# EAGLE design Front Node_MiniLock_SMD Rs (EAGLE 8.0.2)
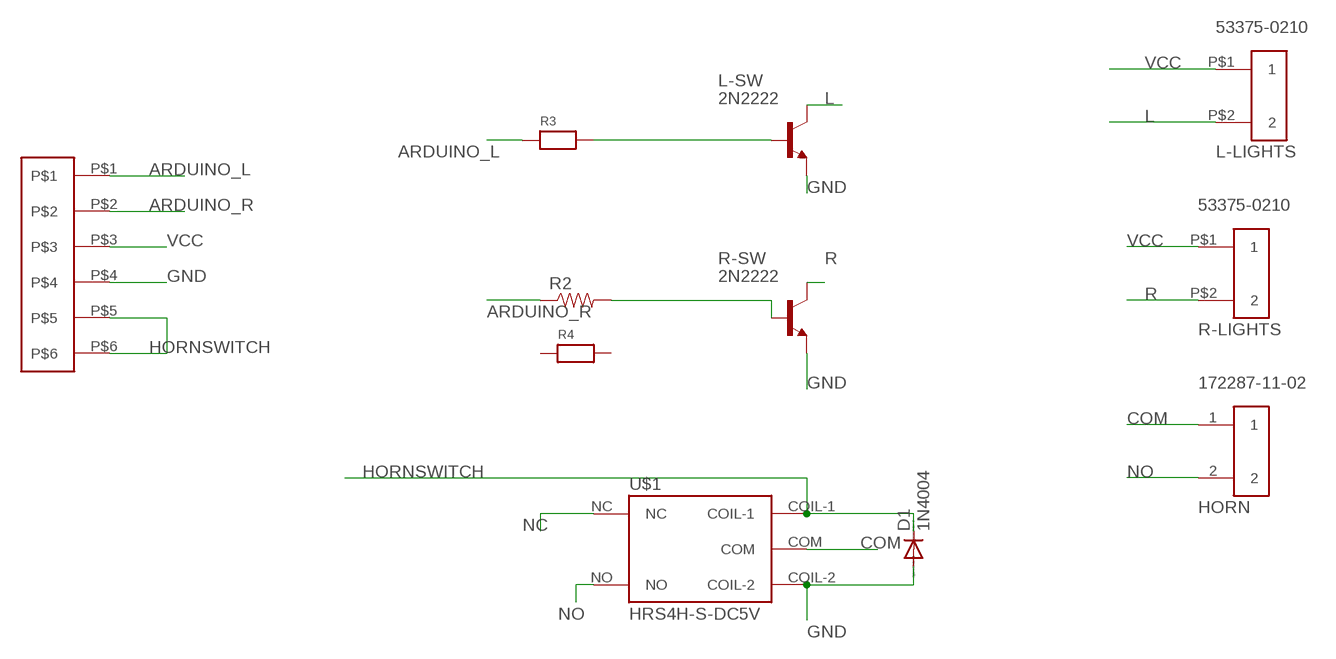
[diagram p0: schematic, sheet 1]

## Parts
ARDUINO  53375-0610  [53375-0610-MINI-LOCK]
D1  1N4004  [DO41-10]
HORN  172287-11-02  [172287-ULTRA-FIT]
L-LIGHTS  53375-0210  [53375-0210-MINI-LOCK]
L-SW  2N2222  [TO18]
R2  RESISTORPTH-1/4W  [AXIAL-0.4]
R3  RESISTOR1206  [1206]
R4  RESISTOR1206  [1206]
R-LIGHTS  53375-0210  [53375-0210-MINI-LOCK]
R-SW  2N2222  [TO18]
U$1  HRS4H-S-DC5V  [RELAY]

## Nets
ARDUINO_L: ARDUINO.P$1 R3.1
ARDUINO_R: ARDUINO.P$2 R2.P$1
COM: HORN.1 U$1.COM
GND: ARDUINO.P$4 D1.A L-SW.1(E) R-SW.1(E) U$1.COIL-2
HORNSWITCH: ARDUINO.P$5 ARDUINO.P$6 D1.C U$1.COIL-1
L: L-LIGHTS.P$2 L-SW.3(C)
N$5: R2.P$2 R-SW.2(B)
N$8: L-SW.2(B) R3.2
NC: U$1.NC
NO: HORN.2 U$1.NO
R: R-LIGHTS.P$2 R-SW.3(C)
VCC: ARDUINO.P$3 L-LIGHTS.P$1 R-LIGHTS.P$1
Unconnected: R4.1 R4.2

## Library data of the parts
ARDUINO = Hooman:53375-0610: Mini-Lock Header 6 pin 53375 series
D1 = diode:1N4004: DIODE general purpose rectifier, 1 A
HORN = Hooman:172287-11-02: Ultra-Fit™ 172287 Header Molex 3.5 mm pitch 2 pin connector header
L-LIGHTS R-LIGHTS = Hooman:53375-0210: Mini-Lock Header 2 pin 53375 series
L-SW R-SW = transistor-npn:2N2222*: NPN Transistor
R2 = SparkFun-Passives:RESISTOR: Resistor Basic schematic elements and footprints for 0603, 1206, and PTH resistors.
R3 R4 = microbuilder:RESISTOR: Resistors 0402 - 0402 Surface Mount Package 22 Ohm 1% 1/16W [Digikey: 311-22.0LRTR-ND] 33 Ohm 5% 1/16W 1.0K 5% 1/16W 1.5K 5% 1/16W 2.0K 1% 1/16W 10.0K 1% 1/16W [Digikey: 311-10.0KLRTR-ND] 10.0K 5% 1/16W [Digikey: RMCF0402JT10K0TR-ND] 12.1K 1% 1/16W [Digikey: 311-22.0LRTR-ND] 100.0K 5% 1/16W 0603 - 0603 Surface Mount Package 0 Ohm 1/10 Watt 1% Resistor 15 Ohm 1/10 Watt 1% Resistor 33 Ohm 1/10 Watt 1% Resistor 49.9 Ohm 1/10 Watt 1% Resistor 100 Ohm 1/10 Watt 1% Resistor 150 Ohm 1/10 Watt 1% Resistor 240 Ohm 1/10 Watt 1% Resistor 390 Ohm 1/10 Watt 1% Resistor 560 Ohm 1/10 Watt 1% Resistor 680 Ohm 1/10 Watt 1% Resistor 750 Ohm 1/10 Watt 1% Resistor 1.0K Ohm 1/10 Watt 1% Resistor 1.5K Ohm 1/10 Watt 1% Resistor 2.0K Ohm 1/10 Watt 1% Resistor 2.2K Ohm 1/10 Watt 1% Resistor 3.3K Ohm 1/10 Watt 1% Resistor 4.7K Ohm 1/10 Watt 1% Resistor 10.0K Ohm 1/10 Watt 1% Resistor 12.0K Ohm 1/10 Watt 1% Resistor 12.1K Ohm 1/10 Watt 1% Resistor 20.0K Ohm 1/10 Watt 1% Resistor 33.0K Ohm 1/10 Watt 1% Resistor 100.0K Ohm 1/10 Watt 1% Resistor 0805 - 0805 Surface Mount Package 0 Ohm 1/8 Watt 1% Resistor 33 Ohm 1/8 Watt 1% Resistor 100 Ohm 1/8 Watt 1% Resistor 150 Ohm 1/8 Watt 1% Resistor 200 Ohm 1/8 Watt 1% Resistor 240 Ohm 1/8 Watt 1% Resistor 330 Ohm 1/8 Watt 1% Resistor 390 Ohm 1/8 Watt 1% Resistor 470 Ohm 1/8 Watt 1% Resistor 1.0K Ohm 1/8 Watt 1% Resistor 1.5K Ohm 1/8 Watt 1% Resistor 2.0K Ohm 1/8 Watt 1% Resistor 4.7K Ohm 1/8 Watt 1% Resistor 5.1K Ohm 1/8 Watt 1% Resistor 5.6K Ohm 1/8 Watt 1% Resistor 10.0K Ohm 1/8 Watt 1% Resistor 22.0K Ohm 1/8 Watt 1% Resistor 33.0K Ohm 1/8 Watt 1% Resistor 100K Ohm 1/8 Watt 1% Resistor 1206 - 1206 Surface Mount Package 2012 - 2010 Surface Mount Package 0.11 Ohm 1/2 Watt 1% Resistor - Digikey: RHM.11UCT-ND
U$1 = Hooman:HRS4H-S-DC5V

## Board
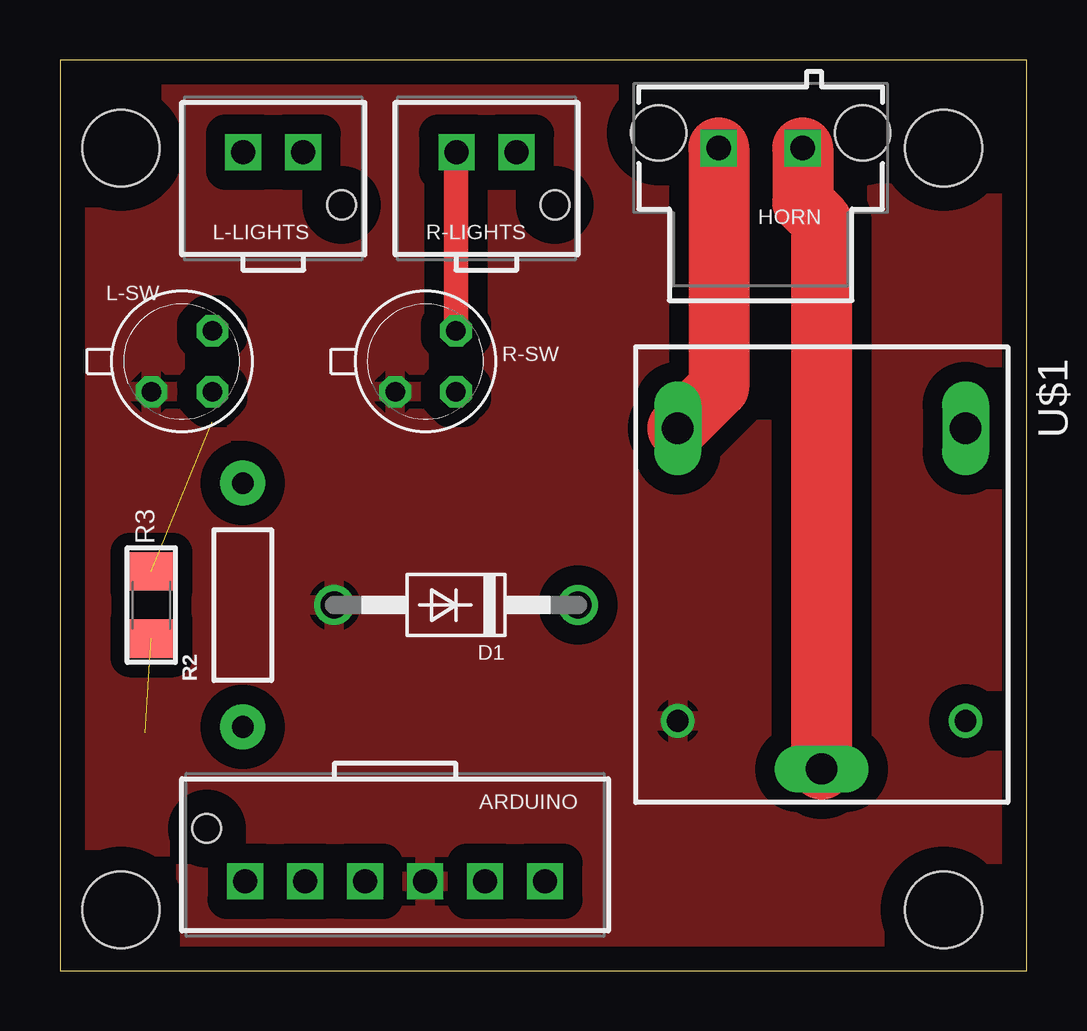
[diagram p1: board, top side]
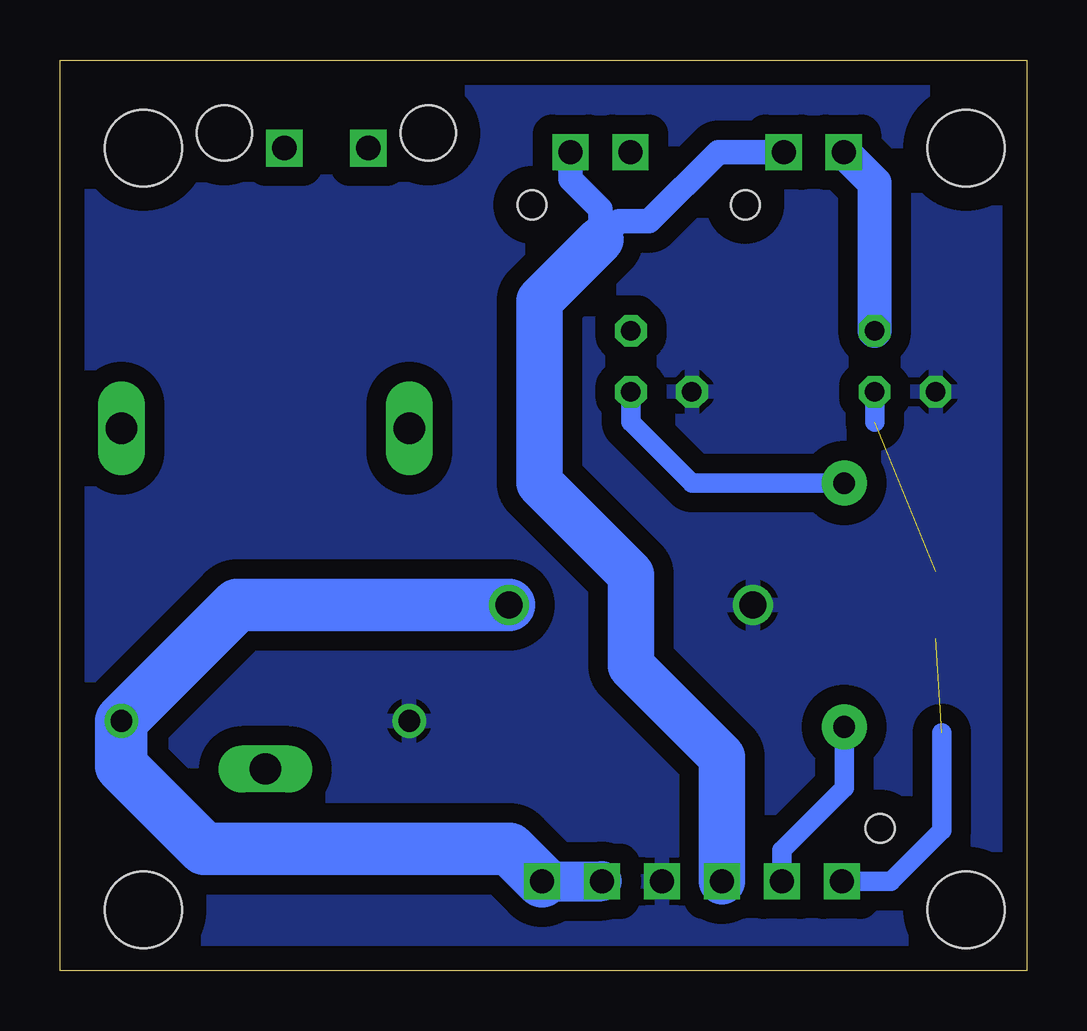
[diagram p2: board, bottom side, seen from below]

Size 40.31 x 37.96 mm. Coordinates in mm from the lower left corner, seen from the top.
Outline: 0,0 40.31,0 40.31,37.96 0,37.96 0,0
Copper layers (1*16): Top 0.035mm / dielectric 1.5mm / Bottom 0.035mm
Design rules "default": minimum track width 10mil, minimum drill 24mil, track to track 8mil, track to pad 8mil, pad to pad 8mil, via to via 8mil, smd to smd 8mil, copper to edge 40mil, drill to drill 8mil, minimum pad ring 10mil, minimum via ring 8mil, stop-mask expansion 4mil, vias tented up to drill 0mil, thermal gap 10mil
Holes 3.2 mm at 2.54,34.29 2.54,2.54 36.83,2.54 36.83,34.29
tKeepout: area 0,38.1 to 40.6,39.4; area -1.3,0 to 0,39.4; area -1.3,-1.3 to 41.9,0; area 40.6,0 to 41.9,39.4

### Footprints (pad centres in the part's own frame; a part is rotated, then mirrored left to right if it is on the bottom)
53375-0610-MINI-LOCK = drill 1 square: P$1 6.25,1.1; P$2 3.75,1.1; P$3 1.25,1.1; P$4 -1.25,1.1; P$5 -3.75,1.1; P$6 -6.25,1.1 | hole 1.2: 7.85,-1.1
DO41-10 = drill 1.118: A 5.08,0; C -5.08,0
172287-ULTRA-FIT = drill 1.02 square: 1 -1.75,0; 2 1.75,0 | hole 2.3: -4.25,-0.63; 4.25,-0.63
53375-0210-MINI-LOCK = drill 1 square: P$1 1.25,1.1; P$2 -1.25,1.1 | hole 1.2: 2.85,-1.1
TO18 = drill 0.813 octagon: 1 -1.27,-1.27; 2 1.27,-1.27; 3 1.27,1.27
AXIAL-0.4 = drill 0.9 pad 1.88: P$1 -5.08,0; P$2 5.08,0
1206 = smd 1.6 x 1.8: 1 -1.4,0; 2 1.4,0
RELAY = drill 0.9: COIL-1 6.1,6; COIL-2 6.1,-6 | drill 1.3 long: COM 8.1,0; NC -6.1,6; NO -6.1,-6

### Placement (x,y rotation side)
ARDUINO  13.97,4.83 180 top
D1  16.51,15.24 180 top
HORN  29.21,34.29 180 top
L-LIGHTS  8.89,33.02 0 top
L-SW  5.08,25.4 0 top
R2  7.62,15.24 90 top
R3  3.81,15.24 90 top
R4  -2.54,-13.97 0 top  (outside the outline)
R-LIGHTS  17.78,33.02 0 top
R-SW  15.24,25.4 0 top
U$1  31.75,16.51 270 top

### Tracks (layer width: path | path; a pad name or v marks a point on that pad's centre or on a via)
ARDUINO_L  (1 unrouted)
  Bottom 0.813: ARDUINO.P$1 5.67,3.73 3.56,5.84 3.56,9.91
ARDUINO_R
  Bottom 0.813: ARDUINO.P$2 10.22,5.02 7.62,7.62 R2.P$1
COM
  Top 2.54: 31.75,31.24 30.99,32 | U$1.COM 31.75,31.24 | HORN.1 30.96,32.03 31.75,31.24
GND
  pour Top (isolate 0.813): 0,38.1 40.64,38.1 40.64,0 0,0
  pour Bottom (isolate 0.813): 0,38.1 40.64,38.1 40.64,0 0,0
HORNSWITCH
  Bottom 1.676: ARDUINO.P$6 ARDUINO.P$5
  Bottom 2.184: ARDUINO.P$6 21.57,5.08 34.29,5.08 37.75,8.54 U$1.COIL-1 32.92,15.24 D1.C
L
  Bottom 1.422: L-SW.3 6.35,32.83 L-LIGHTS.P$2
N$5
  Bottom 0.813: R2.P$2 13.97,20.32 16.51,22.86 R-SW.2
N$8  (1 unrouted)
  Bottom 0.813: 6.35,22.86 L-SW.2
NO
  Top 2.54: HORN.2 27.46,24.32 U$1.NO
R
  Top 1.016: R-SW.3 16.51,34.1 R-LIGHTS.P$2
VCC
  Bottom 1.016: R-LIGHTS.P$1 19.03,33 17.78,31.75 17.78,30.48 17.02,31.24 15.75,31.24 12.87,34.12 L-LIGHTS.P$1
  Bottom 1.93: ARDUINO.P$3 12.72,8.91 16.51,12.7 16.51,16.51 20.32,20.32 20.32,27.94 17.78,30.48